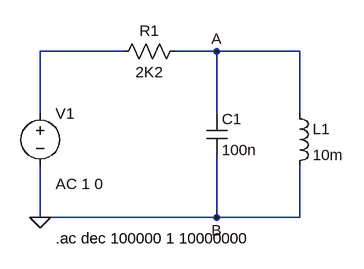
[diagram p0: schematic Circuito_apartadoA.asc]
Circuito_apartadoA.asc, the LTspice schematic file:
Version 4
SHEET 1 880 680
WIRE 64 16 -64 16
WIRE 208 16 144 16
WIRE 336 16 208 16
WIRE -64 112 -64 16
WIRE 208 112 208 16
WIRE 336 112 336 16
WIRE -64 272 -64 192
WIRE 208 272 208 176
WIRE 208 272 -64 272
WIRE 336 272 336 192
WIRE 336 272 208 272
FLAG -64 272 0
FLAG 208 16 A
FLAG 208 272 B
SYMBOL cap 192 112 R0
SYMATTR InstName C1
SYMATTR Value 100n
SYMBOL ind 320 96 R0
SYMATTR InstName L1
SYMATTR Value 10m
SYMBOL voltage -64 96 R0
WINDOW 3 24 96 Invisible 2
WINDOW 123 24 124 Left 2
WINDOW 39 0 0 Left 2
SYMATTR InstName V1
SYMATTR Value SINE(0)
SYMATTR Value2 AC 1 0
SYMBOL res 160 0 R90
WINDOW 0 0 56 VBottom 2
WINDOW 3 32 56 VTop 2
SYMATTR InstName R1
SYMATTR Value 2K2
TEXT -40 304 Left 2 !.ac dec 100000 1 10000000

The netlist it stands for:
* Circuito_apartadoA.asc
C1 A 0 100n
L1 A 0 10m
V1 N001 0 SINE(0) AC 1 0
R1 A N001 2K2
.ac dec 100000 1 10000000
.backanno
.end